# Altium project PCB_Project.PrjPcb
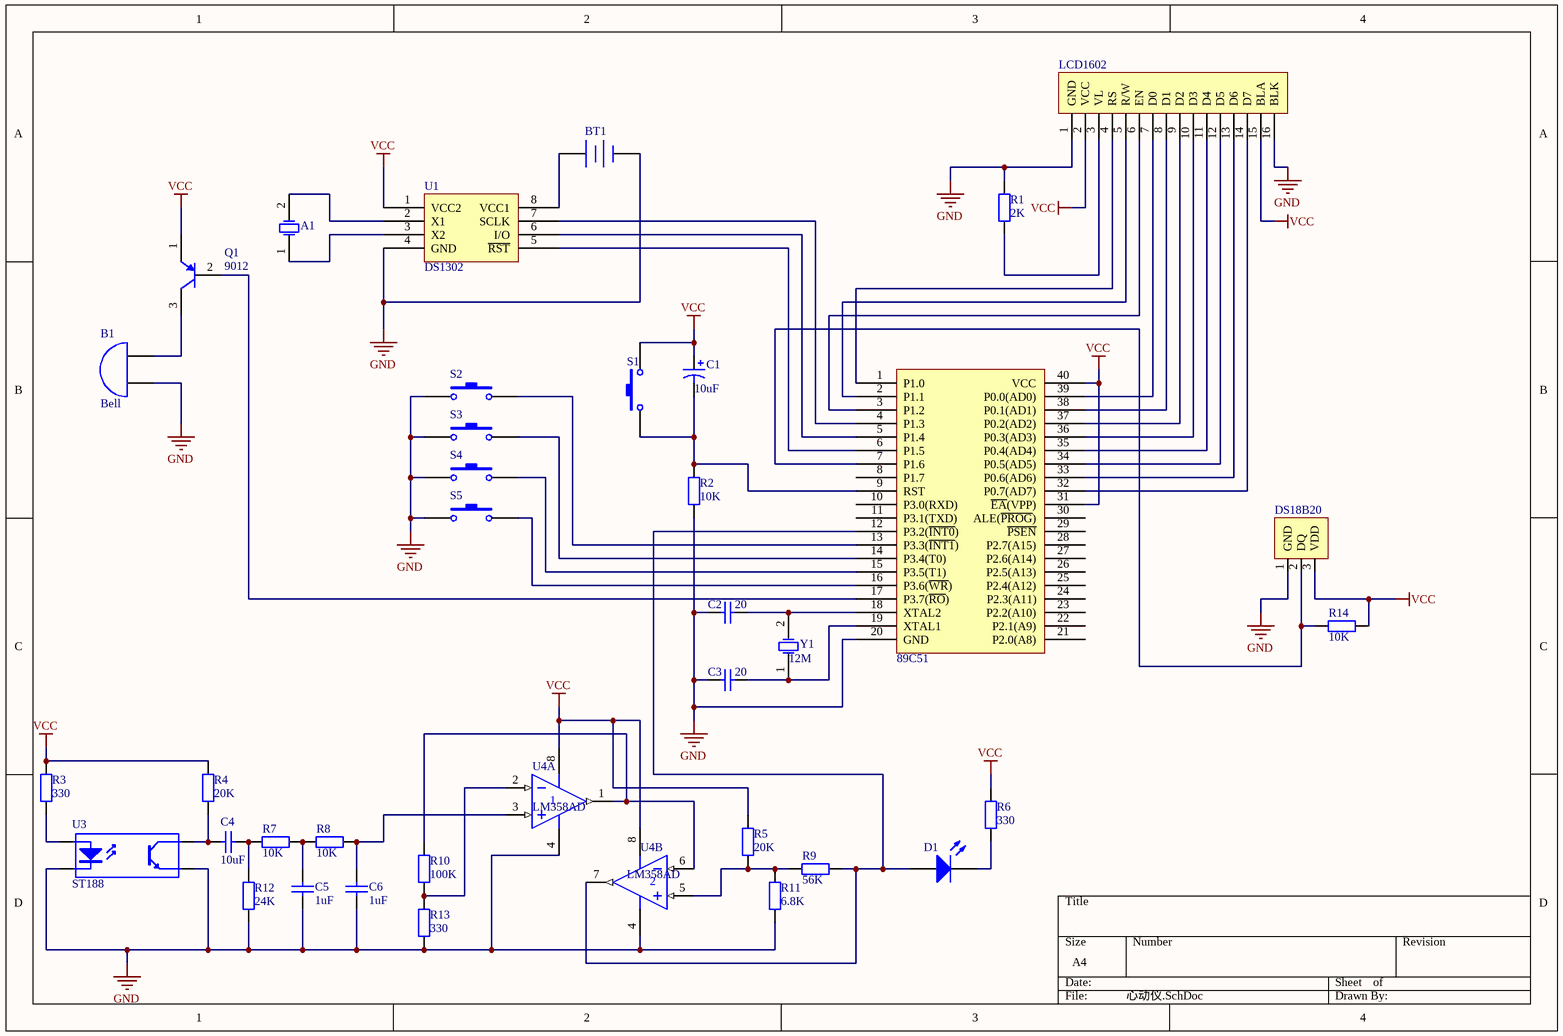
[diagram p0: 心动仪.SchDoc]
1 sheet, 37 parts. Net scope: global (net labels, ports and power ports of the same name join across sheets).
Board file: 心动仪.PcbDoc

## Sheet 心动仪.SchDoc
size A4

### Parts
A1  XTAL  [R38]  (value not drawn)
B1  Bell  [PIN2]
BT1  Battery-N  [BAT-CR2032]  (value not drawn)
C1  value 10uF  [C0805]  (hidden comment: Cap Pol3)
C2  value 20  [RAD-0.3]  (hidden comment: Cap)
C3  value 20  [RAD-0.3]  (hidden comment: Cap)
C4  value 10uF  [RAD-0.3]  (hidden comment: Cap)
C5  value 1uF  [RAD-0.3]  (hidden comment: Cap)
C6  value 1uF  [RAD-0.3]  (hidden comment: Cap)
D1  LED0  [LED-0]  (value not drawn)
Q1  9012  [TO-92(TO-92-3)]
R1  value 2K  [AXIAL-0.3]  (hidden comment: Resistor)
R2  value 10K  [AXIAL-0.3]  (hidden comment: Resistor)
R3  330  [AXIAL-0.6-R]
R4  value 20K  [AXIAL-0.4]  (hidden comment: Res2)
R5  value 20K  [AXIAL-0.4]  (hidden comment: Res2)
R6  value 330  [AXIAL-0.4]  (hidden comment: Res2)
R7  value 10K  [AXIAL-0.4]  (hidden comment: Res2)
R8  value 10K  [AXIAL-0.4]  (hidden comment: Res2)
R9  value 56K  [AXIAL-0.4]  (hidden comment: Res2)
R10  value 100K  [AXIAL-0.4]  (hidden comment: Res2)
R11  value 6.8K  [AXIAL-0.4]  (hidden comment: Res2)
R12  value 24K  [AXIAL-0.4]  (hidden comment: Res2)
R13  value 330  [AXIAL-0.4]  (hidden comment: Res2)
R14  value 10K  [AXIAL-0.3]  (hidden comment: Resistor)
S1  SW-PB  [KEY-pad]  (value not drawn)
S2  SW-PB  [KEY-pad]  (value not drawn)
S3  SW-PB  [KEY-pad]  (value not drawn)
S4  SW-PB  [KEY-pad]  (value not drawn)
S5  SW-PB  [KEY-pad]  (value not drawn)
U1  DS1302  [SOP-8_150mil]
U3  ST188  [DIP-4]
U4  LM358AD  [DIP-8]  (parts A,B of 2)
U5  DS18B20  [BCY-W3/E4]
U?  LCD1602  [LCD1602]
Y1  value 12M  [R38]  (hidden comment: XTAL)
  89C51  [DIP-40]

### Nets
GND: B1.1(A) BT1.1(-) C2.1 C3.1 C5.1 C6.1 R1.2 R2.1 R11.1 R12.1 R13.1 S2.1 S3.1 S4.1 S5.1 U1.4(GND) U3.2(K) U3.3(E) U4.4(V-) U5.1(GND) U?.1(GND) U?.16(BLK) .20(GND)
VCC: C1.1 Q1.1(E) R3.2 R4.2 R5.2 R6.2 R14.1 S1.2 U1.1(VCC2) U4.8(V+) U5.3(VDD) U?.2(VCC) U?.15(BLA) .31(~{EA}(VPP)) .40(VCC)
NetA1_1: A1.1(OSC1) U1.3(X2)
NetA1_2: A1.2(OSC2) U1.2(X1)
NetB1_2: B1.2(B) Q1.3(C)
NetBT1_2: BT1.2(+) U1.8(VCC1)
NetC1_2: C1.2 R2.2 S1.1 .9(RST)
NetC2_2: C2.2 Y1.2(OSC2) .18(XTAL2)
NetC3_2: C3.2 Y1.1(OSC1) .19(XTAL1)
NetC4_1: C4.1 R4.1 U3.4(C)
NetC4_2: C4.2 R7.2 R12.2
NetC5_2: C5.2 R7.1 R8.2
NetC6_2: C6.2 R8.1 U4.3(IN+)
NetD1_1: D1.1(A) R9.1 U4.7(OUT) .12(P3.2(~{INT0}))
NetD1_2: D1.2(K) R6.1
NetQ1_2: Q1.2(B) .17(P3.7(~{RO}))
NetR1_1: R1.1 U?.3(VL)
NetR3_1: R3.1 U3.1(A)
NetR5_1: R5.1 R9.2 R11.2 U4.5(IN+)
NetR10_1: R10.1 R13.2 U4.2(IN-)
NetR10_2: R10.2 U4.1(OUT) U4.6(IN-)
NetR14_2: R14.2 U5.2(DQ) .7(P1.6)
NetS2_2: S2.2 .13(P3.3(~{INT1}))
NetS3_2: S3.2 .14(P3.4(T0))
NetS4_2: S4.2 .15(P3.5(T1))
NetS5_2: S5.2 .16(P3.6(~{WR}))
NetU1_5: U1.5(~{RST}) .6(P1.5)
NetU1_6: U1.6(I/O) .5(P1.4)
NetU1_7: U1.7(SCLK) .4(P1.3)
NetU?_4: U?.4(RS) .1(P1.0)
NetU?_5: U?.5(R/W) .2(P1.1)
NetU?_6: U?.6(EN) .3(P1.2)
NetU?_7: U?.7(D0) .39(P0.0(AD0))
NetU?_8: U?.8(D1) .38(P0.1(AD1))
NetU?_9: U?.9(D2) .37(P0.2(AD2))
NetU?_10: U?.10(D3) .36(P0.3(AD3))
NetU?_11: U?.11(D4) .35(P0.4(AD4))
NetU?_12: U?.12(D5) .34(P0.5(AD5))
NetU?_13: U?.13(D6) .33(P0.6(AD6))
NetU?_14: U?.14(D7) .32(P0.7(AD7))

Not connected (* = marked no-connect by the designer):  8(P1.7) 10(P3.0(RXD)) 11(P3.1(TXD)) 21(P2.0(A8)) 22(P2.1(A9)) 23(P2.2(A10)) 24(P2.3(A11)) 25(P2.4(A12)) 26(P2.5(A13)) 27(P2.6(A14)) 28(P2.7(A15)) 29(~{PSEN}) 30(ALE(~{PROG}))

### Library data of the parts
A1 Y1 = XTAL: Crystal Oscillator; Published: 8-Jun-2000; LatestRevisionDate: 17-Jul-2002; LatestRevisionNote: Re-released for DXP Platform.; PackageReference: R38; Publisher: Altium Limited; PackageDescription: Crystal, Thru-Hole; 2 Leads; Body 3.1 x 8.2 mm (Dia.xH)
B1 = Bell: Electrical Bell; Published: 24-Mar-1999; LatestRevisionDate: 17-Jul-2002; LatestRevisionNote: Re-released for DXP Platform.; PackageReference: PIN2; Publisher: Altium Limited
BT1 = Battery-N: Multicell Battery; Published: 24-Mar-1999; Revision: July-2002: Re-released for DXP Platform.; Publisher: Altium Limited
C1 = Cap Pol3: Polarized Capacitor (Surface Mount); Published: 8-Jun-2000; LatestRevisionDate: 29-May-2009; LatestRevisionNote: IPC-7351 Footprint Added.; PackageReference: C0805; Publisher: Altium Limited; PackageDescription: Chip Capacitor
C2-C6 = Cap: Capacitor; Published: 8-Jun-2000; LatestRevisionDate: 17-Jul-2002; LatestRevisionNote: Re-released for DXP Platform.; PackageReference: RAD-0.3; Publisher: Altium Limited; PackageDescription: Radial Cap, Thru-Hole; 2 Leads; 0.3 in Pin Spacing
D1 = LED0: Typical INFRARED GaAs LED; Published: 8-Jun-2000; LatestRevisionDate: 08-Jul-2005; LatestRevisionNote: Mech Layer 1 removed.; PackageReference: LED-0; Publisher: Altium Limited; PackageDescription: LED; 2 Leads
Q1 = 9012_TO-92: PNP型小功率三极管; datasheet: http://pdf1.alldatasheetcn.com/datasheet-pdf/view/311757/DAYA/9012.html
R3 = Res2_1W: Resistor 直插电阻 1W; Published: 8-Jun-2000; LatestRevisionDate: 17-Jul-2002; LatestRevisionNote: Re-released for DXP Platform.; PackageReference: AXIAL-0.4; Publisher: Altium Limited; Value: 330
R4-R13 = Res2: Resistor; Published: 8-Jun-2000; LatestRevisionDate: 17-Jul-2002; LatestRevisionNote: Re-released for DXP Platform.; PackageReference: AXIAL-0.4; Publisher: Altium Limited; PackageDescription: Axial Device, Thru-Hole; 2 Leads; 0.4 in Pin Spacing
S1-S5 = SW-PB: Switch; Published: 24-Mar-1999; Revision: July-2002: Re-released for DXP Platform.; Publisher: Altium Limited
U1 = DS1302: DS1302 实时时钟
U3 = Optoisolator1: 4-Pin Phototransistor Optocoupler; Published: 24-Mar-1999; LatestRevisionDate: 04-Mar-2005; LatestRevisionNote: Sch pins 3 & 4 Swapped.; DatasheetVersion: Nov-2003; PackageReference: DIP-4; Publisher: Altium Limited
U4 = LM358AD: Dual Operational Amplifier; Published: 15-Apr-2002; LatestRevisionDate: 4-Mar-2005; LatestRevisionNote: Stylized 3D Model Added.; DatasheetDocument: Aug-1988; PackageDocument: Jan-1998; PackageReference: D008; Publisher: Altium Limited; ComponentLink1Description: Manufacturer Link; ComponentLink1URL: http://www.ti.com/
R1 R2 R14 = Resistor: Published: 8-Jun-2000; Revision: July-2002: Re-released for DXP Platform.; Publisher: Altium Limited